# Altium schematic sheet led.SchDoc
size A; SheetNumber: 1; SheetTotal: 1
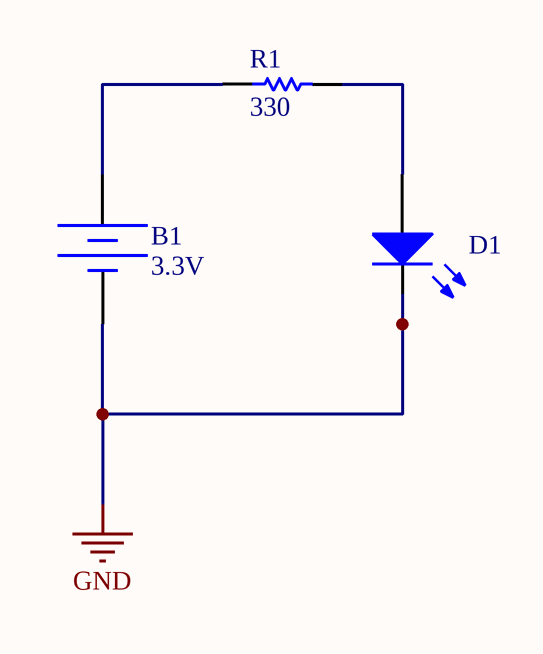
[diagram p0: led.SchDoc]

## Parts
B1  DC Magnitude: 3.3V  (hidden comment: Constant Voltage Source)
D1  Light-Emitting Diode  (value not drawn)
R1  value 330  (hidden comment: Resistor)

## Nets
GND: B1.2 D1.2(K)
NetB1_1: B1.1 R1.1
NetD1_1: D1.1(A) R1.2

## Library data of the parts
B1 = Battery: SimulationGenericComponent: True
D1 = LED: AF: 1; BV: 0; BV_MAX: 1e99; EG: 1.11; FC: 0.5; IBV: 0.001; IS: 1e-14; MJSW: 0.33; NTUN: 30; TNOM: 27; XTI: 3; SimulationGenericComponent: True; CJO: 0; CJP: 0; CTA: 0; CTP: 0; FCS: 0.5; FV_MAX: 1e99; IKF: 0; IKR: 0; ISR: 1e-14; JSW: 0; JTUN: 0; JTUNSW: 0; KEG: 1; KF: 0; LEVEL: 1; N: 1; NBV: 1; NR: 1; NS: 1; PHP: 1; RS: 0; TCV: 0; TLEV: 0; TLEVC: 0; TM1: 0; TM2: 0; TPB: 0; TPHP: 0; TRS: 0; TRS2: 0; TT: 0; TTT1: 0; TTT2: 0; VJ: 1; XTITUN: 3
R1 = Resistor: TC1: 0; SimulationGenericComponent: True; TC2: 0